# EAGLE design miniuno (EAGLE 9.3.1)
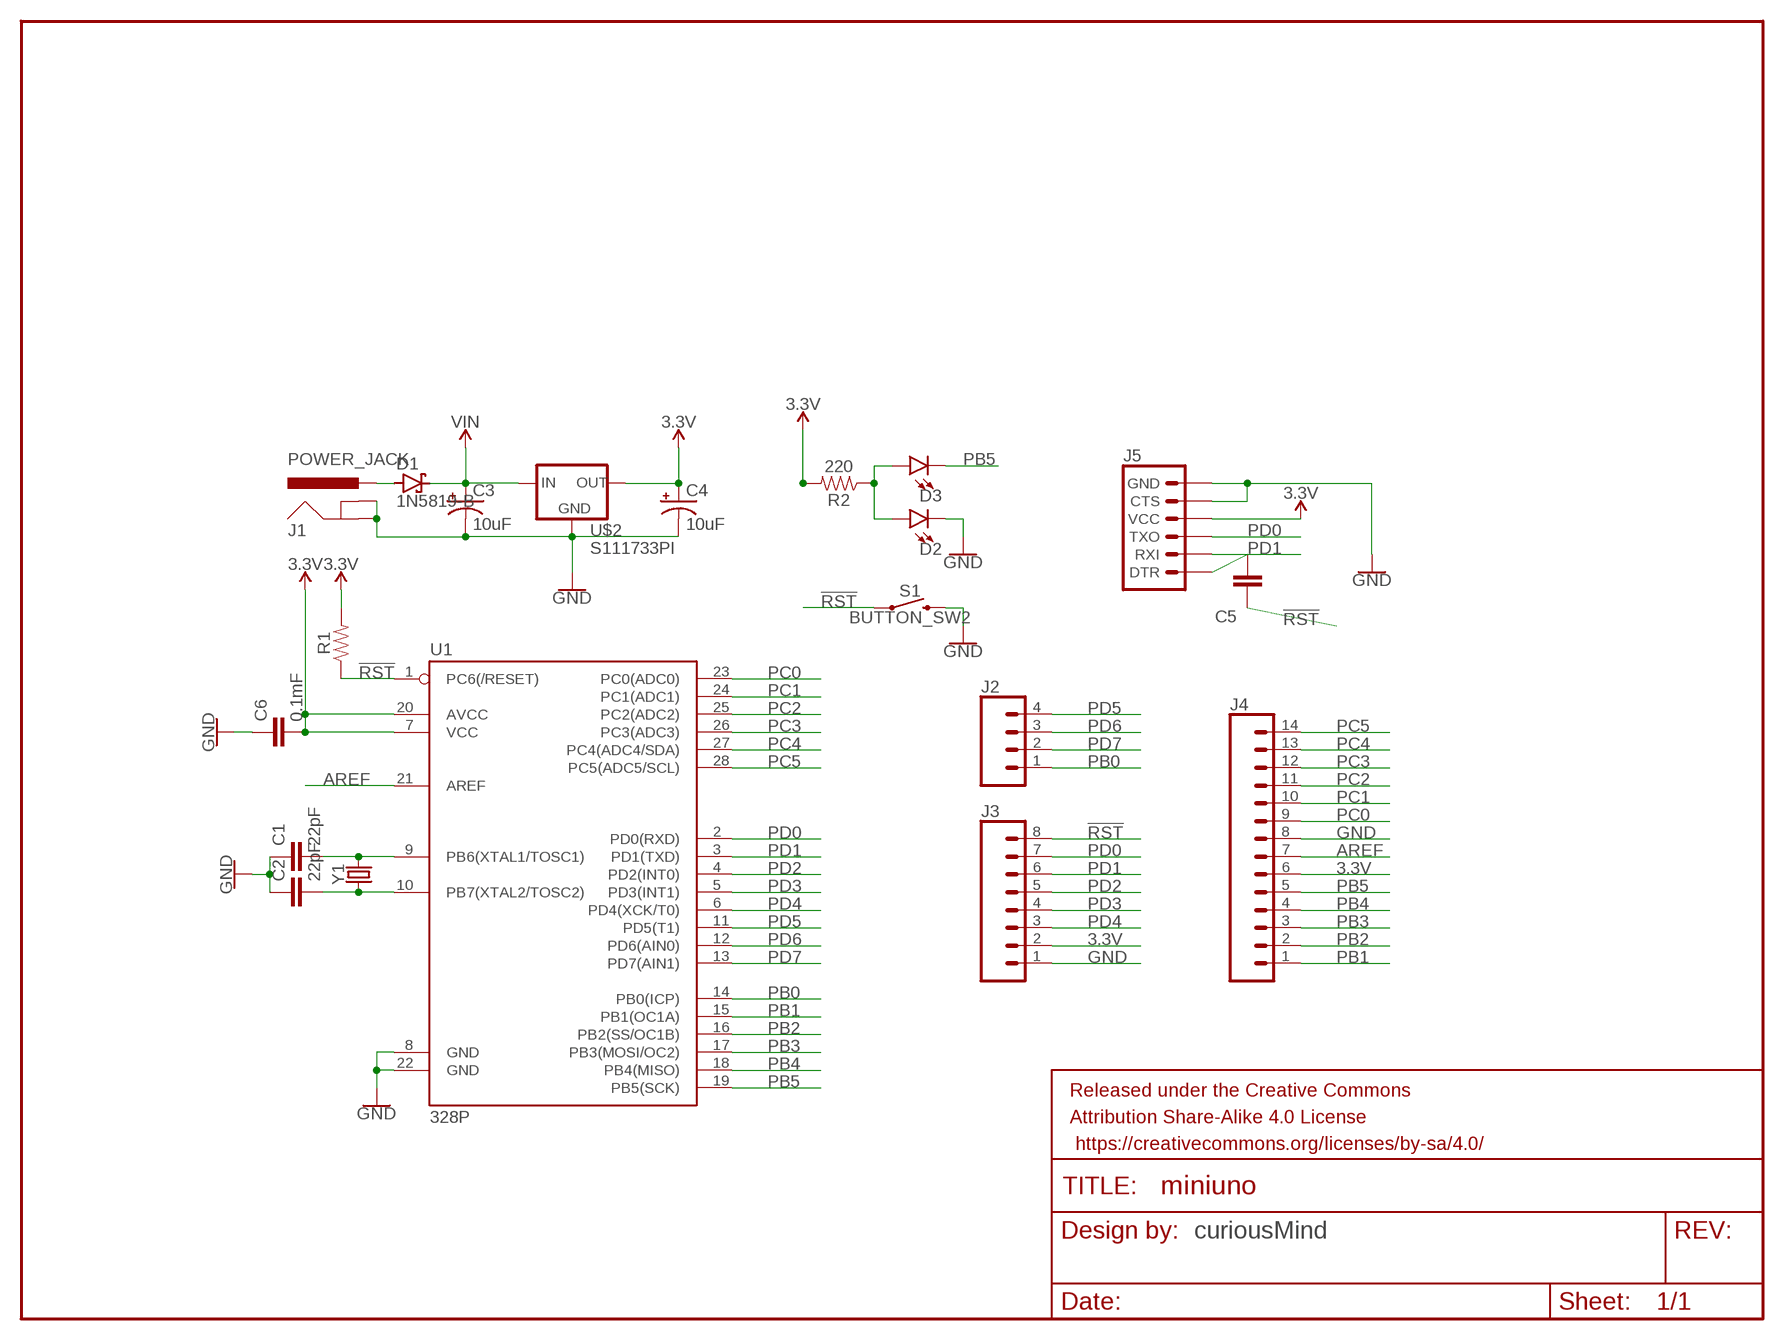
[diagram p0: schematic, sheet 1]

## Parts
C1  22pF  22PF-PTH-2.54MM-200V-5%  [CAP-PTH-2.54]
C2  22pF  22PF-PTH-2.54MM-200V-5%  [CAP-PTH-2.54]
C3  10uF  10UF-POLAR-RADIAL-2.5MM-KIT-25V-20%  [CPOL-RADIAL-2.5MM-5MM-KIT]
C4  10uF  10UF-POLAR-RADIAL-2.5MM-KIT-25V-20%  [CPOL-RADIAL-2.5MM-5MM-KIT]
C5  0.1uF  C5/2.5  [C5B2.5]
C6  0.1mF  22PF-PTH-2.54MM-200V-5%  [CAP-PTH-2.54]
D1  1N5819-B  [DO41-7.6]
D2  LED-3MM-NO_SILK  [LED_3MM-NS]
D3  LED-3MM-NO_SILK  [LED_3MM-NS]
FRAME1  FRAME-LETTER  [CREATIVE_COMMONS]
J1  POWER_JACK  [POWER_JACK_PTH]
J2  CONN_04  [1X04]
J3  CONN_08"  [1X08]
J4  CONN_14  [1X14]
J5  6_PIN_SERIAL_TARGETPTH-KIT  [1X06-KIT]
R1  RESISTORAXIAL-0.3  [AXIAL-0.3]
R2  220  RESISTORAXIAL-0.3  [AXIAL-0.3]
S1  BUTTON_SW2  [BUTTON_SW2]
U1  328P  ATMEGA328P_PDIP  [DIP28]
U$2  S111733PI  [S1117XXPI-TO-220]
Y1  CRYSTALPTH-HC49US  [HC49US]

## Nets
3.3V: C4.1(+) C6.2 J3.2 J4.6 J5.4(VCC) R1.P$2 R2.P$2 U1.7(VCC) U1.20(AVCC) U$2.OUT
!RST: C5.1 J3.8 R1.P$1 S1.1 U1.1(PC6(/RESET))
AREF: J4.7 U1.21(AREF)
GND: C1.1 C2.1 C3.2(-) C4.2(-) C6.1 D2.K(C) J1.GND J1.GNDBREAK J3.1 J4.8 J5.5(CTS) J5.6(GND) S1.2 U1.8(GND) U1.22(GND) U$2.GND
N$1: C1.2 U1.9(PB6(XTAL1/TOSC1)) Y1.2
N$2: C2.2 U1.10(PB7(XTAL2/TOSC2)) Y1.1
N$3: D1.A J1.PWR
N$4: C5.2 J5.1(DTR)
N$5: D2.A D3.A R2.P$1
PB0: J2.1 U1.14(PB0(ICP))
PB1: J4.1 U1.15(PB1(OC1A))
PB2: J4.2 U1.16(PB2(SS/OC1B))
PB3: J4.3 U1.17(PB3(MOSI/OC2))
PB4: J4.4 U1.18(PB4(MISO))
PB5: D3.K(C) J4.5 U1.19(PB5(SCK))
PC0: J4.9 U1.23(PC0(ADC0))
PC1: J4.10 U1.24(PC1(ADC1))
PC2: J4.11 U1.25(PC2(ADC2))
PC3: J4.12 U1.26(PC3(ADC3))
PC4: J4.13 U1.27(PC4(ADC4/SDA))
PC5: J4.14 U1.28(PC5(ADC5/SCL))
PD0: J3.7 J5.3(TXO) U1.2(PD0(RXD))
PD1: J3.6 J5.2(RXI) U1.3(PD1(TXD))
PD2: J3.5 U1.4(PD2(INT0))
PD3: J3.4 U1.5(PD3(INT1))
PD4: J3.3 U1.6(PD4(XCK/T0))
PD5: J2.4 U1.11(PD5(T1))
PD6: J2.3 U1.12(PD6(AIN0))
PD7: J2.2 U1.13(PD7(AIN1))
VIN: C3.1(+) D1.C U$2.IN

## Notes on the sheet
- curiousMind

## Library data of the parts
C1 C2 = SparkFun-Capacitors:22PF: 22pF ceramic capacitors A capacitor is a passive two-terminal electrical component used to store electrical energy temporarily in an electric field.; PROD_ID: CAP-09128
C3 C4 = SparkFun-Capacitors:10UF-POLAR: 10.0µF polarized capacitors A capacitor is a passive two-terminal electrical component used to store electrical energy temporarily in an electric field.; PROD_ID: CAP-08440
C5 = capacitor-wima:C: CAPACITOR naming: grid - package width
C6 = SparkFun-Capacitors:22PF: 22pF ceramic capacitors A capacitor is a passive two-terminal electrical component used to store electrical energy temporarily in an electric field.; PROD_ID: CAP-09128; VALUE: 22pF
D1 = diode:1N581*: 1.0A SCHOTTKY BARRIER RECTIFIER Source: http://www.diodes.com/datasheets/ds23001.pdf
D2 D3 = SparkFun-LED:LED: LED (Generic) Standard schematic elements and footprints for 5mm, 3mm, 1206, and 0603 sized LEDs. Generic LEDs with no color specified.
FRAME1 = SparkFun-Aesthetics:FRAME-LETTER: Schematic Frame - Letter Standard 8.5x11 US Letter frame
J1 = SparkFun-Connectors:POWER_JACK: Power Jack Connector This is the standard 5.5mm barrel jack for power. The PTH is the most common, proven, reliable, footprint. The Slot footprint only works if the mill layer is transmitted to the PCB fab house so be warned. Here are the connectors we sell at SparkFun: DC Barrel Power Jack/Connector <https://www.sparkfun.com/products/119> (PRT-00119) DC Barrel Power Jack/Connector (SMD) <https://www.sparkfun.com/products/12748> (PRT-12748) DC Barrel Jack Adapter - Breadboard Compatible <https://www.sparkfun.com/products/10811> (PRT-10811) It is used on this SparkFun product (and many, many others): SparkFun RedBoard - Programmed with Arduino <https://www.sparkfun.com/products/12757> (DEV-12757) Also, if you need a mating power supply or connector, please check these out: Wall Adapter Power Supply - 9VDC 650mA <https://www.sparkfun.com/products/298> (TOL-00298) DC Barrel Jack Adapter - Male <https://www.sparkfun.com/products/10287> (PRT-10287); PROD_ID: CONN-08197
J2 = SparkFun-Connectors:CONN_04: Multi connection point. Often used as Generic Header-pin footprint for 0.1 inch spaced/style header connections On any of the 0.1 inch spaced packages, you can populate with these: Break Away Headers - Straight <https://www.sparkfun.com/products/116> (PRT-00116) Break Away Male Headers - Right Angle <https://www.sparkfun.com/products/553> (PRT-00553) Female Headers <https://www.sparkfun.com/products/115> (PRT-00115) Break Away Headers - Machine Pin <https://www.sparkfun.com/products/117> (PRT-00117) Break Away Female Headers - Swiss Machine Pin <https://www.sparkfun.com/products/743> (PRT-00743) For SCREWTERMINALS and SPRING TERMINALS visit here: Screw Terimnals on SparkFun.com <https://www.sparkfun.com/search/results?term=Screw+Terminals> (5mm/3.5mm/2.54mm spacing) This device is also useful as a general connection point to wire up your design to another part of your project. Our various solder wires solder well into these plated through hole pads. Hook-Up Wire - Assortment (Stranded, 22 AWG) <https://www.sparkfun.com/products/11375> (PRT-11375) Hook-Up Wire - Assortment (Solid Core, 22 AWG) <https://www.sparkfun.com/products/11367> (PRT-11367) View the entire wire category on our website here <https://www.sparkfun.com/categories/141> Special notes: Molex polarized connector foot print use with SKU : PRT-08231 with associated crimp pins and housings. 1MM SMD Version SKU: PRT-10208; PROD_ID: CONN-09696
J3 = SparkFun-Connectors:CONN_08: Multi connection point. Often used as Generic Header-pin footprint for 0.1 inch spaced/style header connections On any of the 0.1 inch spaced packages, you can populate with these: Break Away Headers - Straight <https://www.sparkfun.com/products/116> (PRT-00116) Break Away Male Headers - Right Angle <https://www.sparkfun.com/products/553> (PRT-00553) Female Headers <https://www.sparkfun.com/products/115> (PRT-00115) Break Away Headers - Machine Pin <https://www.sparkfun.com/products/117> (PRT-00117) Break Away Female Headers - Swiss Machine Pin <https://www.sparkfun.com/products/743> (PRT-00743) Arduino Stackable Header - 8 Pin <https://www.sparkfun.com/products/9279> (PRT-09279) For SCREWTERMINALS and SPRING TERMINALS visit here: Screw Terimnals on SparkFun.com <https://www.sparkfun.com/search/results?term=Screw+Terminals> (5mm/3.5mm/2.54mm spacing) This device is also useful as a general connection point to wire up your design to another part of your project. Our various solder wires solder well into these plated through hole pads. Hook-Up Wire - Assortment (Stranded, 22 AWG) <https://www.sparkfun.com/products/11375> (PRT-11375) Hook-Up Wire - Assortment (Solid Core, 22 AWG) <https://www.sparkfun.com/products/11367> (PRT-11367) View the entire wire category on our website here <https://www.sparkfun.com/categories/141> Special notes: Molex polarized connector foot print use with SKU : PRT-08231 with associated crimp pins and housings. 1MM SMD Version SKU: PRT-10208 NOTES ON THE VARIANTS LOCK and LOCK_LONGPADS... This footprint was designed to help hold the alignment of a through-hole component (i.e. 6-pin header) while soldering it into place. You may notice that each hole has been shifted either up or down by 0.005 of an inch from it's more standard position (which is a perfectly straight line). This slight alteration caused the pins (the squares in the middle) to touch the edges of the holes. Because they are alternating, it causes a "brace" to hold the component in place. 0.005 has proven to be the perfect amount of "off-center" position when using our standard breakaway headers. Although looks a little odd when you look at the bare footprint, once you have a header in there, the alteration is very hard to notice. Also,if you push a header all the way into place, it is covered up entirely on the bottom side.; PROD_ID: CONN-08438
J4 = SparkFun-Connectors:CONN_14: Multi connection point. Often used as Generic Header-pin footprint for 0.1 inch spaced/style header connections On any of the 0.1 inch spaced packages, you can populate with these: Break Away Headers - Straight <https://www.sparkfun.com/products/116> (PRT-00116) Break Away Male Headers - Right Angle <https://www.sparkfun.com/products/553> (PRT-00553) Female Headers <https://www.sparkfun.com/products/115> (PRT-00115) Break Away Headers - Machine Pin <https://www.sparkfun.com/products/117> (PRT-00117) Break Away Female Headers - Swiss Machine Pin <https://www.sparkfun.com/products/743> (PRT-00743) For SCREWTERMINALS and SPRING TERMINALS visit here: Screw Terimnals on SparkFun.com <https://www.sparkfun.com/search/results?term=Screw+Terminals> (5mm/3.5mm/2.54mm spacing) This device is also useful as a general connection point to wire up your design to another part of your project. Our various solder wires solder well into these plated through hole pads. Hook-Up Wire - Assortment (Stranded, 22 AWG) <https://www.sparkfun.com/products/11375> (PRT-11375) Hook-Up Wire - Assortment (Solid Core, 22 AWG) <https://www.sparkfun.com/products/11367> (PRT-11367) View the entire wire category on our website here <https://www.sparkfun.com/categories/141> Special notes: Molex polarized connector foot print use with SKU : PRT-08231 with associated crimp pins and housings. 1MM SMD Version SKU: PRT-10208 NOTES ON THE VARIANTS LOCK and LOCK_LONGPADS... This footprint was designed to help hold the alignment of a through-hole component (i.e. 6-pin header) while soldering it into place. You may notice that each hole has been shifted either up or down by 0.005 of an inch from it's more standard position (which is a perfectly straight line). This slight alteration caused the pins (the squares in the middle) to touch the edges of the holes. Because they are alternating, it causes a "brace" to hold the component in place. 0.005 has proven to be the perfect amount of "off-center" position when using our standard breakaway headers. Although looks a little odd when you look at the bare footprint, once you have a header in there, the alteration is very hard to notice. Also,if you push a header all the way into place, it is covered up entirely on the bottom side.
J5 = SparkFun-Connectors:6_PIN_SERIAL_TARGET: 6-pin header connection for use with the "FTDI BASIC" pinout - TARGET SIDE. Also known as "Arduino Serial Program Header". It is used to mate with our FTDI Basic serial programmers using the Arduino IDE. Note, this device has "TARGET" in the name. It is intended to be used on a design that contains a target micro-controller that you wish to program. The "sister" device, named "CABLE" is inteneded to be used on a design that usually lives on the end of your USB cable and prvides the converter chip (FTDI232 or FTDI231x) to commnicate serial RX/TX. You can populate with some of these: Break Away Headers - Straight <https://www.sparkfun.com/products/116> (PRT-00116) For reference (or to suit your programming needs) check out these designs: SparkFun FTDI Basic Breakout - 5V <https://www.sparkfun.com/products/9716> (DEV-09716) SparkFun FTDI Basic Breakout - 3.3V <https://www.sparkfun.com/products/9873> (DEV-09873) SparkFun FTDI SmartBasic <https://www.sparkfun.com/products/12935> (DEV-12935) SparkFun Beefy 3 - FTDI Basic Breakout <https://www.sparkfun.com/products/13746> (DEV-13746)
R1 R2 = SparkFun-Resistors:RESISTOR: Generic Resistor Package
S1 = myParts:BUTTON_SW2: 2 connector push button
U1 = SparkFun-IC-Microcontroller:ATMEGA328P_PDIP: Atmel 328P Through hole ATMEGA328P uC used in the Arduino 32kb flash, 1k EEPROM, 2k SRAM Datasheet <http://www.sparkfun.com/datasheets/Components/SMD/ATMega328.pdf> SparkFun Products Storefront component: AVR 28 Pin 20MHz 32K 6A/D - ATMega328P <https://www.sparkfun.com/products/9061> (COM-09061) SparkFun Simon Says - Through-Hole Soldering Kit <https://www.sparkfun.com/products/10547> (KIT-10547) SparkFun Learn to Solder - Simon Says <https://www.sparkfun.com/products/13708> (KIT-13708) SparkFun BigTime Watch Kit <https://www.sparkfun.com/products/11734> (KIT-11734) SparkFun ClockIt <https://www.sparkfun.com/products/10930> (KIT-10930) SparkFun Serial Enabled LCD Kit <https://www.sparkfun.com/products/10097> (LCD-10097) SparkFun Simon Tilts - Through Hole Soldering Kit <https://www.sparkfun.com/products/12634> (KIT-12634) SparkFun Frequency Counter Kit <https://www.sparkfun.com/products/10140> (KIT-10140) FabFM Radio Kit <https://www.sparkfun.com/products/11043> (KIT-11043) SparkFun Binary Blaster Kit <https://www.sparkfun.com/products/12037> (KIT-12037) SparkFun Metro-Gnome <https://www.sparkfun.com/products/9236> (KIT-09236) ATmega328 with Arduino Optiboot (Uno) <https://www.sparkfun.com/products/10524> (DEV-10524); PROD_ID: IC-09136
U$2 = myParts:S111733PI: AUK S111733PI 3.3v linear voltage regulator
Y1 = SparkFun-Clocks:CRYSTAL: Crystals (Generic) These are passive quartz crystals, which can be used as a clock source for a microcontroller. Crystal's are two-terminal devices. They require external "load" capacitors to generate an oscillating signal.

## Board
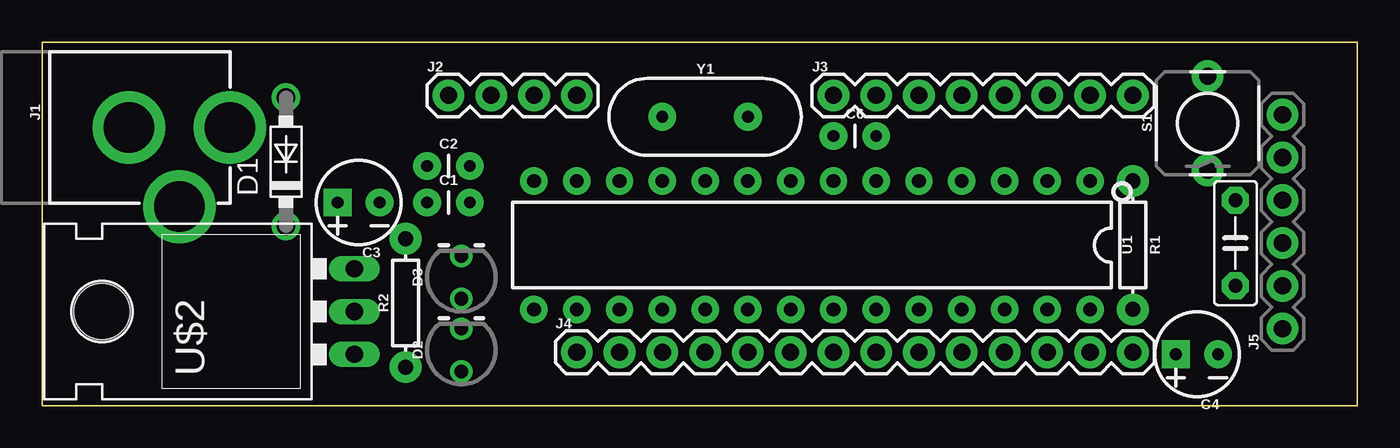
[diagram p1: board, top side]
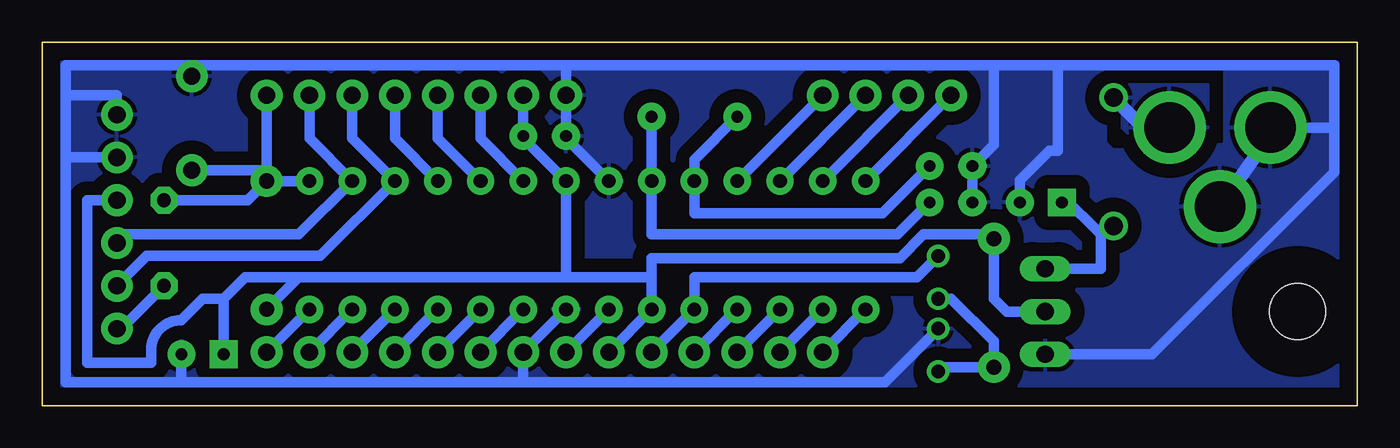
[diagram p2: board, bottom side, seen from below]

Size 78.11 x 21.58 mm. Coordinates in mm from the lower left corner, seen from the top.
Outline: 0,0 78.11,0 78.11,21.58 0,21.58 0,0
Copper layers (1*16): Top 0.035mm / dielectric 1.5mm / Bottom 0.035mm
Design rules "default": minimum track width 6mil, minimum drill 0.35mm, track to track 6mil, track to pad 6mil, pad to pad 6mil, via to via 6mil, smd to smd 6mil, copper to edge 40mil, drill to drill 6mil, minimum pad ring 10mil, minimum via ring 8mil, stop-mask expansion 4mil, vias tented up to drill 0mil, thermal gap 10mil

### Footprints (pad centres in the part's own frame; a part is rotated, then mirrored left to right if it is on the bottom)
CAP-PTH-2.54 = drill 0.7 pad 1.651: 1 -1.27,0; 2 1.27,0
CPOL-RADIAL-2.5MM-5MM-KIT = drill 0.7 pad 1.651 square: 1 1.25,0 | drill 0.7 pad 1.651: 2 -1.25,0
C5B2.5 = drill 0.813 pad 1.6 octagon: 1 -2.54,0; 2 2.54,0
DO41-7.6 = drill 1.1 pad 1.7: A 3.81,0; C -3.81,0
LED_3MM-NS = drill 0.813: A -1.27,0; K 1.27,0
POWER_JACK_PTH = drill 2.997 pad 4.318: GND 0,7.7; GNDBREAK 4.7,10.7; PWR 0,13.7
1X04 = drill 1.016 pad 1.88: 1 0,0; 2 2.54,0; 3 5.08,0; 4 7.62,0
1X08 = drill 1.016 pad 1.88: 1 0,0; 2 2.54,0; 3 5.08,0; 4 7.62,0; 5 10.16,0; 6 12.7,0; 7 15.24,0; 8 17.78,0
1X14 = drill 1.016 pad 1.88: 1 0,0; 2 2.54,0; 3 5.08,0; 4 7.62,0; 5 10.16,0; 6 12.7,0; 7 15.24,0; 8 17.78,0; 9 20.32,0; 10 22.86,0; 11 25.4,0; 12 27.94,0; 13 30.48,0; 14 33.02,0
1X06-KIT = drill 1.016 pad 1.88: 1 0,0; 2 2.54,0; 3 5.08,0; 4 7.62,0; 5 10.16,0; 6 12.7,0
AXIAL-0.3 = drill 0.9 pad 1.88: P$1 -3.81,0; P$2 3.81,0
BUTTON_SW2 = drill 1.016 pad 1.88: 1 -2.794,0; 2 2.794,0
DIP28 = drill 0.813 pad 1.626: 1 -16.51,-3.81; 2 -13.97,-3.81; 3 -11.43,-3.81; 4 -8.89,-3.81; 5 -6.35,-3.81; 6 -3.81,-3.81; 7 -1.27,-3.81; 8 1.27,-3.81; 9 3.81,-3.81; 10 6.35,-3.81; 11 8.89,-3.81; 12 11.43,-3.81; 13 13.97,-3.81; 14 16.51,-3.81; 15 16.51,3.81; 16 13.97,3.81; 17 11.43,3.81; 18 8.89,3.81; 19 6.35,3.81; 20 3.81,3.81; 21 1.27,3.81; 22 -1.27,3.81; 23 -3.81,3.81; 24 -6.35,3.81; 25 -8.89,3.81; 26 -11.43,3.81; 27 -13.97,3.81; 28 -16.51,3.81
S1117XXPI-TO-220 = drill 1.016 long: GND -2.54,-3.81; IN 2.54,-3.81; OUT 0,-3.81 | hole 3.302: 0,11.176
HC49US = drill 0.7 pad 1.651: 1 -2.54,0; 2 2.54,0

### Placement (x,y rotation side)
C1  24.13,12.06 0 top
C2  24.13,14.22 0 top
C3  18.8,12.06 180 top
C4  68.58,3.05 180 top
C5  70.87,9.65 270 top
C6  48.26,16 0 top
D1  14.48,14.48 90 top
D2  24.89,3.3 90 top
D3  24.89,7.62 90 top
FRAME1  17.78,-8.89 0 top  (outside the outline)
J1  -2.54,16.51 270 top
J2  24.13,18.41 0 top
J3  46.99,18.41 0 top
J4  31.75,3.17 0 top
J5  73.66,4.57 90 top
R1  64.77,9.53 270 top
R2  21.59,6.1 90 top
S1  69.22,16.76 90 top
U1  45.72,9.53 180 top
U$2  14.73,5.59 90 top
Y1  39.37,17.14 0 top

### Tracks (layer width: path | path; a pad name or v marks a point on that pad's centre or on a via)
3.3V
  Bottom 0.61: 46.99,7.62 U1.7 49.53,15.88 C6.2 49.53,16.51 J3.2 | 41.91,7.62 U1.20 J4.6 | 41.91,7.62 41.91,8.76 27.18,8.76 25.78,10.16 21.84,10.16 R2.P$2 21.59,6.35 20.83,5.59 U$2.OUT | 41.91,7.62 46.99,7.62 | 46.99,7.62 62.87,7.62 | 62.87,7.62 R1.P$2 | J5.4 75.44,12.19 75.44,2.54 71.63,2.54 71.63,3.3 arc90 69.85,5.08 68.58,6.35 67.31,6.35 | 67.31,6.35 66.04,7.62 62.87,7.62 | 67.31,6.35 67.31,3.83 C4.1
!RST
  Bottom 0.61: J3.8 64.77,13.97 | 64.77,13.97 R1.P$1 | R1.P$1 U1.1 | R1.P$1 65.91,12.19 C5.1 | S1.1 64.77,13.97
AREF
  Bottom 0.61: J4.7 U1.21
GND
  Bottom 0.61: 76.71,18.41 76.71,20.19 69.22,20.19 | 76.71,18.41 76.71,14.73 | 76.71,14.73 76.71,1.4 69.85,1.4 | 46.99,20.19 69.22,20.19 | 69.85,1.4 49.53,1.4 | U1.22 J4.8 49.53,1.4 | U1.8 46.99,15.88 C6.1 46.99,16.51 J3.1 46.99,20.19 | 76.71,18.41 73.66,18.41 J5.6 | 1.37,16.51 1.37,20.19 17.78,20.19 | 1.37,16.51 1.37,13.87 12.19,3.05 U$2.GND | 46.99,20.19 21.59,20.19 | 21.59,20.19 17.78,20.19 | J1.GND 1.37,16.51 | J5.5 76.71,14.73 | S1.2 69.22,20.19 | C3.2 20.05,13.38 18.3,15.13 17.78,15.13 17.78,20.19 | C1.1 C2.1 21.59,15.49 21.59,20.19 | D2.K 28.07,1.4 49.53,1.4 | C4.2 69.85,3.03 69.85,1.4
  Bottom 0.813: J1.GND 5.16,16.08 J1.GNDBREAK
  pour Bottom (isolate 0.813, rank 5): 0,21.59 78.74,21.59 78.74,0 0,0
N$1
  Bottom 0.61: Y1.2 U1.9 41.91,10.16 27.3,10.16 C1.2
N$2
  Bottom 0.61: Y1.1 39.37,14.61 U1.10 39.37,11.43 28.19,11.43 C2.2
N$3
  Bottom 0.813: D1.A 12.7,16.51 J1.PWR
  pour Bottom (isolate 0.61): 8.89,19.05 8.89,16.51 10.16,15.24 12.7,15.24 13.97,16.51 13.97,19.05
N$4
  Bottom 0.61: C5.2 73.41,4.57 J5.1
N$5
  Bottom 0.61: D2.A 25.15,2.29 R2.P$1 21.59,3.81 24.13,6.35 D3.A
PB0
  Bottom 0.61: J2.1 U1.14
PB1
  Bottom 0.61: J4.1 U1.15
PB2
  Bottom 0.61: J4.2 U1.16
PB3
  Bottom 0.61: J4.3 U1.17
PB4
  Bottom 0.61: J4.4 U1.18
PB5
  Bottom 0.61: J4.5 U1.19 39.37,7.62 26.16,7.62 D3.K
PC0
  Bottom 0.61: J4.9 U1.23
PC1
  Bottom 0.61: J4.10 U1.24
PC2
  Bottom 0.61: J4.11 U1.25
PC3
  Bottom 0.61: J4.12 U1.26
PC4
  Bottom 0.61: J4.13 U1.27
PC5
  Bottom 0.61: J4.14 U1.28
PD0
  Bottom 0.61: J3.7 62.23,15.88 U1.2 62.87,10.16 73.15,10.16 J5.3
PD1
  Bottom 0.61: J3.6 59.69,15.88 U1.3 61.59,8.89 71.88,8.89 J5.2
PD2
  Bottom 0.61: J3.5 57.15,15.88 U1.4
PD3
  Bottom 0.61: J3.4 54.61,15.88 U1.5
PD4
  Bottom 0.61: J3.3 52.07,15.88 U1.6
PD5
  Bottom 0.61: J2.4 U1.11
PD6
  Bottom 0.61: J2.3 U1.12
PD7
  Bottom 0.61: J2.2 U1.13
VIN
  Bottom 0.61: 15.24,10.16 15.24,8.13 U$2.IN | C3.1 17.55,12.47 15.24,10.16 | D1.C 15.24,10.16

### Text on the board
Document: curiousMind
tDocu: D5 D6 D7 D8 | RST RX TX D2 D3 D4 3V GND | D8 / D7 / D6 / D5 | G / 3V / D4 / D3 / D2 / TX / RX / RS | D9 10 11 12 13 3V R G A0 A1 A2 A3 A4 A5 | DTR TX RX 3V G GND